# Altium project MB1814.PrjPcb (part 2 of 2)

## Sheet Connectors.SchDoc: Connectors
size A4; Date: Not used; ApprovedBy: Not used; CheckedBy: Not used; Author: Not used; CompanyName: STMicroelectronics; DrawnBy: Not used; Engineer: Not used; Organization: Not used; Address1: Not used; Address2: Not used; Address3: Not used; Address4: Not used; DocumentNumber: 6; Revision: Not used; SheetNumber: 6; SheetTotal: 8; CurrentTime: Not used; CurrentDate: Not used; Time: Not used; DocumentFullPathAndName: Not used; DocumentName: Not used; ModifiedDate: Not used; ImagePath: Not used; ProjectName: Not used; Application_BuildNumber: Not used
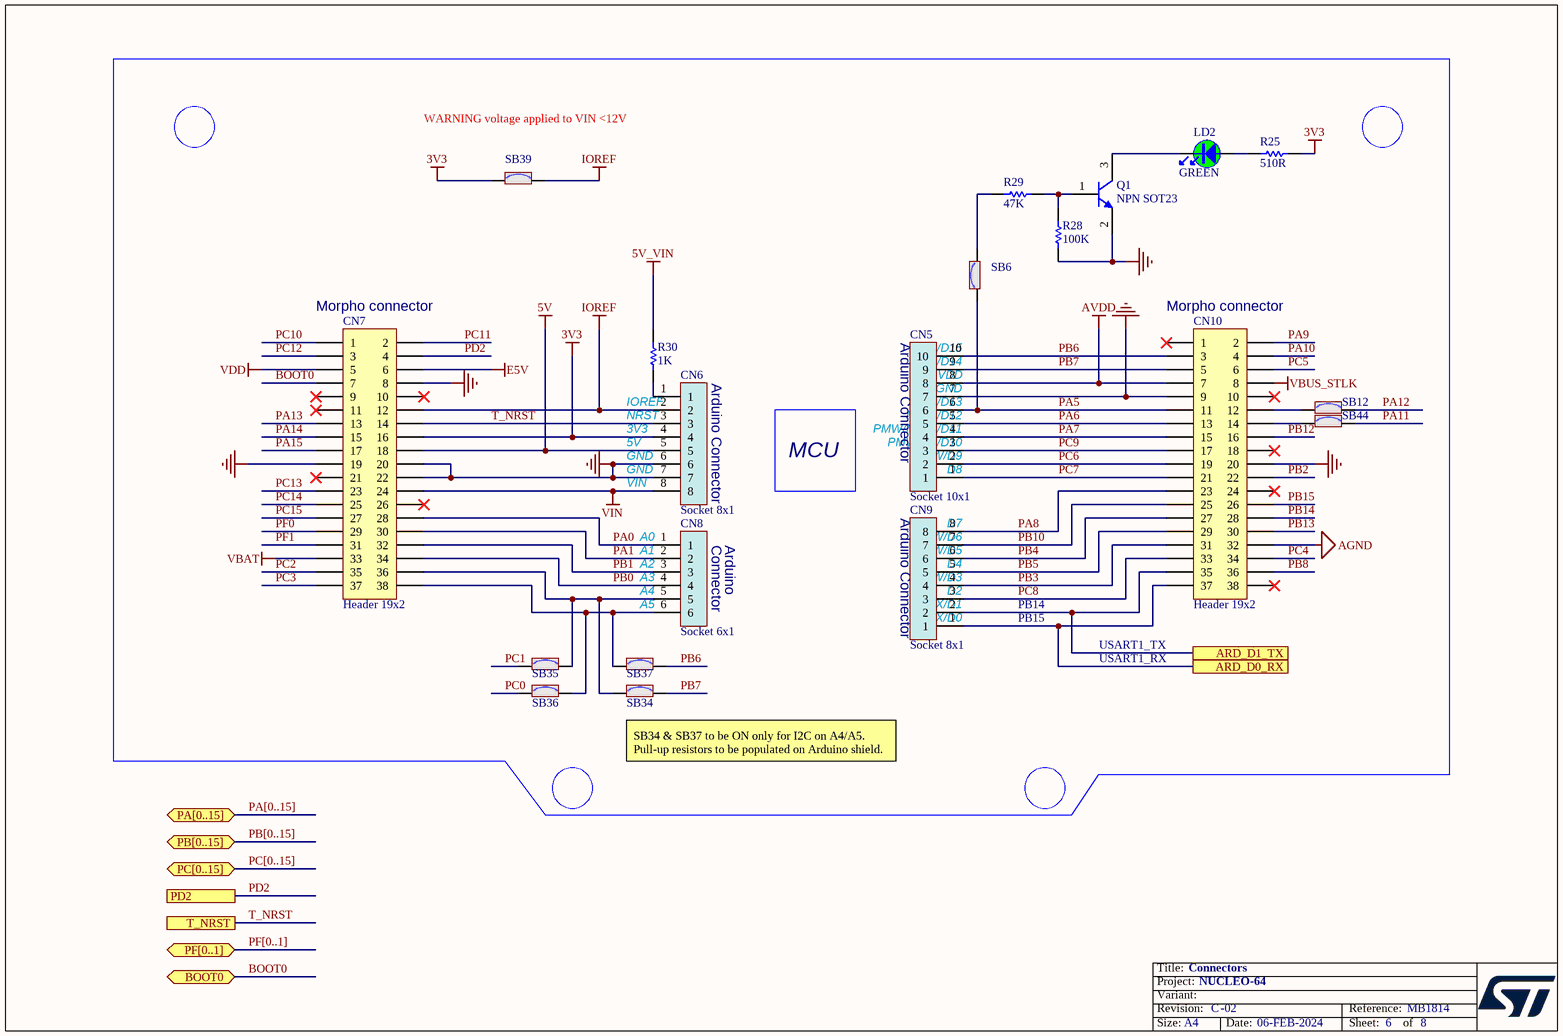
[diagram p6: Connectors.SchDoc]

### Parts
CN5  Socket 10x1  [CON_SAMTEC_SSQ-110-03-F-S]
CN6  Socket 8x1  [CON_SAMTEC_SSQ-108-03-F-S]
CN7  value Header 19x2  [CON_SAMTEC_TSW-119-09-X-D]
CN8  Socket 6x1  [CON_SAMTEC_SSQ-106-03-F-S]
CN9  Socket 8x1  [CON_SAMTEC_SSQ-108-03-F-S]
CN10  value Header 19x2  [CON_SAMTEC_TSW-119-09-X-D]
LD2  value GREEN  [LED_0603_OSRAM_LG-Q396-PS-35_GREEN_1A2K_H0P4]  (hidden comment: LED_green)
Q1  value NPN SOT23  [NPN_SOT23]
R25  value 510R  [R0603]
R28  value 100K  [R0603]
R29  value 47K  [R0603]
R30  value 1K  [R0603]
SB6  (no value)  [SOLDER-BRIDGE_R0603-0R]
SB12  (no value)  [SOLDER-BRIDGE_R0603-0R]
SB34  (no value)  [SOLDER-BRIDGE_R0603-0R]
SB35  (no value)  [SOLDER-BRIDGE_R0603-0R]
SB36  (no value)  [SOLDER-BRIDGE_R0603-0R]
SB37  (no value)  [SOLDER-BRIDGE_R0603-0R]
SB39  (no value)  [SOLDER-BRIDGE_R0603-0R]
SB44  (no value)  [SOLDER-BRIDGE_R0603-0R]

### Ports
ARD_D0_RX, ARD_D1_TX, BOOT0 (bidir), PA[0..15] (bidir), PB[0..15] (bidir), PC[0..15] (bidir), PD2, PF[0..1] (bidir), T_NRST

### Nets
3V3: CN6.4 CN7.16 R25.1 SB39.1
5V: CN6.5 CN7.18
5V_VIN: R30.2
AGND: CN10.32
AVDD: CN5.8 CN10.7
E5V: CN7.6
GND: CN5.7 CN6.6 CN6.7 CN7.8 CN7.19 CN7.20 CN7.22 CN10.9 CN10.20 Q1.2(E) R28.1
IOREF: CN6.2 CN7.12 SB39.2
VBAT: CN7.33
VBUS_STLK: CN10.8
VDD: CN7.5
VIN: CN6.8 CN7.24
ARD_D0_RX: CN9.1 CN10.37 ; port ARD_D0_RX
ARD_D1_TX: CN9.2 CN10.35 ; port ARD_D1_TX
BOOT0: CN7.7 ; port BOOT0
PA0: CN7.28 CN8.1
PA1: CN7.30 CN8.2
PA5: CN5.6 CN10.11 SB6.1
PA6: CN5.5 CN10.13
PA7: CN5.4 CN10.15
PA8: CN9.8 CN10.23
PA9: CN10.2
PA10: CN10.4
PA11: SB44.2
PA12: SB12.2
PA13: CN7.13
PA14: CN7.15
PA15: CN7.17
PB0: CN7.34 CN8.4
PB1: CN7.32 CN8.3
PB2: CN10.22
PB3: CN9.4 CN10.31
PB4: CN9.6 CN10.27
PB5: CN9.5 CN10.29
PB6: CN5.10 CN10.3 SB37.2
PB7: CN5.9 CN10.5 SB34.2
PB8: CN10.36
PB10: CN9.7 CN10.25
PB12: CN10.16
PB13: CN10.30
PB14: CN10.28
PB15: CN10.26
PC0: SB36.1
PC1: SB35.1
PC2: CN7.35
PC3: CN7.37
PC4: CN10.34
PC5: CN10.6
PC6: CN5.2 CN10.19
PC7: CN5.1 CN10.21
PC8: CN9.3 CN10.33
PC9: CN5.3 CN10.17
PC10: CN7.1
PC11: CN7.2
PC12: CN7.3
PC13: CN7.23
PC14: CN7.25
PC15: CN7.27
PD2: CN7.4 ; port PD2
PF0: CN7.29
PF1: CN7.31
T_NRST: CN6.3 CN7.14 ; port T_NRST
NetCN6_1: CN6.1 R30.1
NetCN7_36: CN7.36 CN8.5 SB34.1 SB35.2
NetCN7_38: CN7.38 CN8.6 SB36.2 SB37.1
NetCN10_12: CN10.12 SB12.1
NetCN10_14: CN10.14 SB44.1
NetLD2_1: LD2.1 R25.2
NetLD2_2: LD2.2 Q1.3(C)
NetQ1_1: Q1.1(B) R28.2 R29.2
NetR29_1: R29.1 SB6.2

Not connected (* = marked no-connect by the designer): CN7 9* 10* 11* 21* 26*; CN10 1* 10* 18* 24* 38*

### Buses and harness runs
bus PA[0..15] = port PA[0..15]
bus PB[0..15] = port PB[0..15]
bus PC[0..15] = port PC[0..15]
bus PF[0..1] = port PF[0..1]

### Notes on the sheet
- WARNING voltage applied to VIN <12V
- (near CN7) Morpho connector
- (near CN10) Morpho connector
- (near CN6) Arduino Connector
- (near CN5) Arduino Connector
- (near CN5) SDA/D14
- (near CN5) SCL/D15
- (near CN5) AVDD
- (near CN6) 5V
- 3V3
- NRST
- IOREF
- (near CN5) PMW/CS/D10
- (near CN5) SCK/D13
- (near CN5) MISO/D12
- (near CN5) PMW/MOSI/D11
- (near CN5) GND
- (near CN6) VIN
- (near CN6) GND
- MCU
- (near CN9) Arduino Connector
- (near CN5) D8
- (near CN5) PMW/D9
- (near CN8) A0
- (near CN8) A1
- (near CN8) A2
- (near CN8) A3
- (near CN8) Connector
- (near CN8) Arduino
- (near CN9) D4
- (near CN9) PMW/D3
- (near CN9) PMW/D5
- (near CN9) PMW/D6
- (near CN9) D7
- (near CN8) A4
- (near CN8) A5
- (near CN9) RX/D0
- (near CN9) TX/D1
- (near CN9) D2
- PB15
- PB14
- USART1_TX
- USART1_RX
- (near SB34) SB34 & SB37 to be ON only for I2C on A4/A5.
  Pull-up resistors to be populated on Arduino shield.
- Title:
- Project:
- Size:
- Revision:
- Variant:
- -
- Date:
- Reference:
- Sheet:
- of

### Library data of the parts
CN5 = MCD-02625: Socket, 10x1, 2.54mm, VR, TH, T=8.51mm/10mm; Part_Type: Connector; Part_Preference: Recommended; Manufacturer: SAMTEC; Manufacturer_Part_Number: SSQ-110-03-F-S; Order_Code_RS: 154-8308; Component_Country_Of_Origin: China, Costa Rica,  Malaysia, Vietnam, USA; ShowFields: YES; ID: 4731; Internal_Part_Number: MCD-02625; Value: Socket 10x1; Status: Checked; ComponentLink1URL: http://tunmcdsvn.tun.st.com/Component_Documentation_Library/Trunk/Connector/SAMTEC_SSQ_Series/; Order_Code_Digikey: SAM10010-ND; Order_Code_Farnell: 2667433
CN6 CN9 = MCD-02624: Socket, 8x1, 2.54mm, VR, TH, T=8.51mm/10mm; Part_Type: Connector; Part_Preference: Recommended; Manufacturer: SAMTEC; Manufacturer_Part_Number: SSQ-108-03-F-S; Order_Code_RS: 180-0395; Component_Country_Of_Origin: China, Costa Rica,  Malaysia, Vietnam, USA; ShowFields: YES; ID: 4730; Internal_Part_Number: MCD-02624; Value: Socket 8x1; Status: Checked; ComponentLink1URL: http://tunmcdsvn.tun.st.com/Component_Documentation_Library/Trunk/Connector/SAMTEC_SSQ_Series/; Order_Code_Digikey: SAM11912-ND; Order_Code_Farnell: 2505051
CN7 CN10 = MCD-00213: Header, 19x2, 2,54mm, VR, TH, Height 5.84mm/10.16mm; Manufacturer_Part_Number: TSW-119-09-x-D; Manufacturer: SAMTEC; Part_Type: Connector; Provided_By: SUBCO; Internal_Part_Number: MCD-00213; ECCN_US: n/a; ECCN_EU: n/a; ComponentLink1Description: Datasheet; Status: Released; ComponentLink1URL: http://tunmcdsvn.tun.st.com/Component_Datasheet_Library/Trunk/Connectors/Samtec_TSW-HTSW-series
CN8 = MCD-02623: Socket, 6x1, 2.54mm, VR, TH, T=8.51mm/10mm; Part_Type: Connector; Part_Preference: Recommended; Manufacturer: SAMTEC; Manufacturer_Part_Number: SSQ-106-03-F-S; Order_Code_RS: 180-0379; Component_Country_Of_Origin: China, Costa Rica,  Malaysia, Vietnam, USA; ShowFields: YES; ID: 4729; Internal_Part_Number: MCD-02623; Value: Socket 6x1; Status: Checked; ComponentLink1URL: http://tunmcdsvn.tun.st.com/Component_Documentation_Library/Trunk/Connector/SAMTEC_SSQ_Series/; Order_Code_Digikey: SAM10004-ND; Order_Code_Farnell: 2578705
LD2 = MCD-00588: LED Green, 0603 SMD, Forward Voltage Typ=2V, Max=2.5V; Part_Type: Display; Manufacturer_Part_Number: LG Q396-PS-35; Manufacturer: OSRAM OPTO SEMICONDUCTORS; Alternate_Manufacturer_Part_Number: VLMTG1300-GS08; Alternate_Manufacturer: VISHAY SEMICONDUCTOR OPTO DIVISION; Provided_By: SUBCO; Internal_Part_Number: MCD-00588; Status: Released; Package: LED 0603; ComponentLink1Description: Datasheet; ComponentLink1URL: http://tunmcdsvn.tun.st.com/Component_Datasheet_Library/Trunk/Display/OSRAM_LED_GREEN_LG Q396-PS-35; Order_Code_Digikey: LG Q396-PS-35-ND; ECCN_US: n/a; ECCN_EU: n/a
Q1 = MCD-00073: NPN Bipolar Transistor; Part_Type: IC; Manufacturer_Part_Number: BSR14; Manufacturer: ON SEMICONDUCTOR; Alternate_Manufacturer_Part_Number: MMBT2222LT1G / MMBT2222ALT1G / MMBT2222ALT3G; ECCN_US: EAR99; ECCN_EU: NEC; Provided_By: SUBCO; Revision: *; Internal_Part_Number: MCD-00073; Status: Released; ComponentLink1Description: Datasheet; ComponentLink1URL: http://tunmcdsvn.tun.st.com/Component_Datasheet_Library/Trunk/IC/NXP_Transistor_BSR14; Alternate_Manufacturer: ON SEMICONDUCTOR; Package: SOT23
R25 = MCD-00225: Resistor,510R,0603,1%,1/10W; Manufacturer_Part_Number: RC0603FR-07510RL; Manufacturer: YAGEO; ECCN_US: EAR99; ECCN_EU: NEC; Provided_By: SUBCO; Internal_Part_Number: MCD-00225; ComponentLink1Description: Datasheet; Status: Released; Part_Type: Resistor; Package: R0603; ComponentLink1URL: http://tunmcdsvn.tun.st.com/Component_Datasheet_Library/Trunk/Resistors/Yageo_Resistor_RC0603-series
R28 = MCD-00223: Resistor,100K,0603,1%,1/10W; Manufacturer_Part_Number: RC0603FR-07100KL; Manufacturer: YAGEO; Provided_By: Subcon; Initial_Board_Reference: MB1319; Internal_Part_Number: MCD-00223; Status: Released; Part_Type: Resistor; ComponentLink1Description: Yageo_Resistor_RC0603-series.pdf; ECCN_US: n/a; ECCN_EU: n/a; Package: R0603; ComponentLink1URL: http://tunmcdsvn.tun.st.com/Component_Datasheet_Library/Trunk/Resistors/Yageo_Resistor_RC0603-series
R29 = MCD-00222: Resistor,47K,0603,1%,1/10W; Manufacturer_Part_Number: RC0603FR-0747KL; Manufacturer: YAGEO; ECCN_US: EAR99; ECCN_EU: NEC; Provided_By: SUBCO; Internal_Part_Number: MCD-00222; Status: Released; Part_Type: Resistor; ComponentLink1Description: Datasheet; Package: R0603; ComponentLink1URL: http://tunmcdsvn.tun.st.com/Component_Datasheet_Library/Trunk/Resistors/Yageo_Resistor_RC0603-series
R30 = MCD-00070: Resistor,1K,0603,1%,1/10W; Manufacturer_Part_Number: RC0603FR-071KL; Manufacturer: YAGEO; Provided_By: Subcon; Initial_Board_Reference: MB1274; Internal_Part_Number: MCD-00070; ComponentLink1Description: Yageo_Resistor_RC0603-series.pdf; ECCN_US: n/a; ECCN_EU: n/a; Status: Released; Part_Type: Resistor; Package: R0603; ComponentLink1URL: http://tunmcdsvn.tun.st.com/Component_Datasheet_Library/Trunk/Resistors/Yageo_Resistor_RC0603-series
SB6 SB12 SB34-SB37 SB39 SB44 = MCD-00071: Solder Bridge ON; Part_Type: Mechanical; Manufacturer_Part_Number: RC0603JR-070RL; Manufacturer: YAGEO; Provided_By: SUBCO; Internal_Part_Number: MCD-00071; ECCN_US: n/a; ECCN_EU: n/a; Status: Released; Package: SB0603; ComponentLink1Description: Datasheet; ComponentLink1URL: http://tunmcdsvn.tun.st.com/Component_Datasheet_Library/Trunk/Resistors/Yageo_Resistor_RC0603-series

## Sheet STLINK_V3EC.SchDoc: STLINK_V3EC
size A3; Date: Not used; ApprovedBy: Not used; CheckedBy: Not used; Author: Not used; CompanyName: STMicroelectronics; DrawnBy: Not used; Engineer: Not used; Organization: Not used; Address1: Not used; Address2: Not used; Address3: Not used; Address4: Not used; DocumentNumber: 8; Revision: Not used; SheetNumber: 8; SheetTotal: 8; CurrentTime: Not used; CurrentDate: Not used; Time: Not used; DocumentFullPathAndName: Not used; DocumentName: Not used; ModifiedDate: Not used; ImagePath: Not used; ProjectName: Not used; Application_BuildNumber: Not used
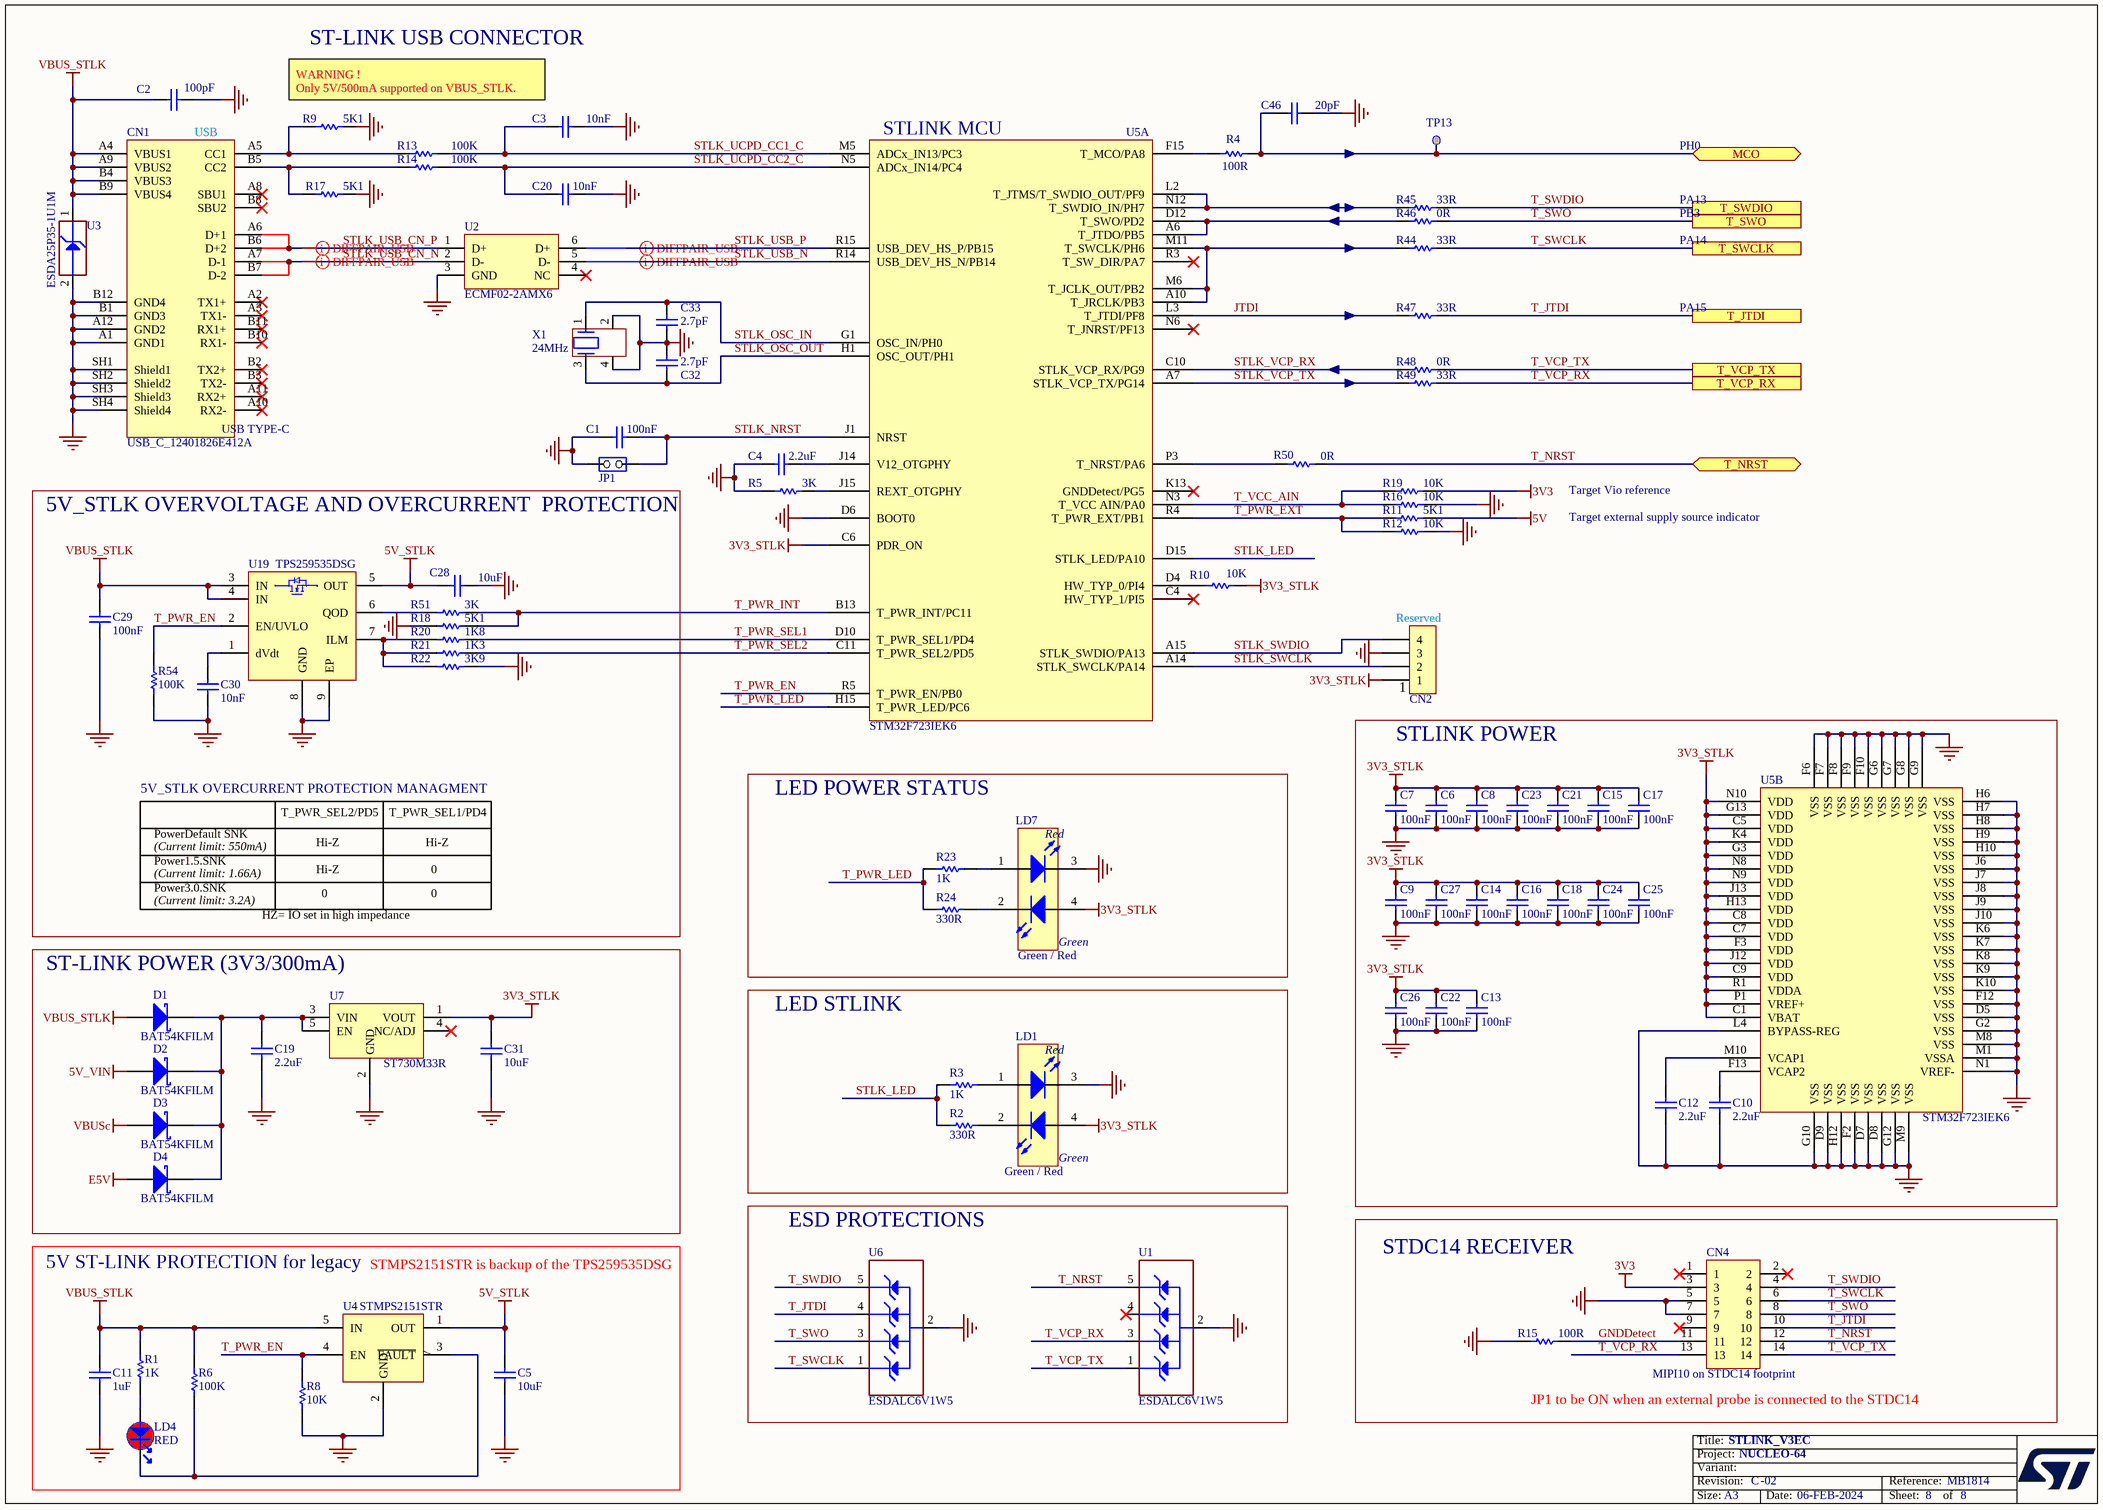
[diagram p7: STLINK_V3EC.SchDoc]

### Parts
C1  value 100nF  [C0402]  (hidden comment: Capacitor)
C2  value 100pF  [C0402]  (hidden comment: Capacitor)
C3  value 10nF  [C0402]  (hidden comment: Capacitor)
C4  value 2.2uF  [C0402]  (hidden comment: Capacitor)
C5  value 10uF  [C0603]  (hidden comment: Capacitor)
C6  value 100nF  [C0402]  (hidden comment: Capacitor)
C7  value 100nF  [C0402]  (hidden comment: Capacitor)
C8  value 100nF  [C0402]  (hidden comment: Capacitor)
C9  value 100nF  [C0402]  (hidden comment: Capacitor)
C10  value 2.2uF  [C0402]  (hidden comment: Capacitor)
C11  value 1uF  [C0603]  (hidden comment: Capacitor)
C12  value 2.2uF  [C0402]  (hidden comment: Capacitor)
C13  value 100nF  [C0402]  (hidden comment: Capacitor)
C14  value 100nF  [C0402]  (hidden comment: Capacitor)
C15  value 100nF  [C0402]  (hidden comment: Capacitor)
C16  value 100nF  [C0402]  (hidden comment: Capacitor)
C17  value 100nF  [C0402]  (hidden comment: Capacitor)
C18  value 100nF  [C0402]  (hidden comment: Capacitor)
C19  value 2.2uF  [C0805]  (hidden comment: Capacitor)
C20  value 10nF  [C0402]  (hidden comment: Capacitor)
C21  value 100nF  [C0402]  (hidden comment: Capacitor)
C22  value 100nF  [C0402]  (hidden comment: Capacitor)
C23  value 100nF  [C0402]  (hidden comment: Capacitor)
C24  value 100nF  [C0402]  (hidden comment: Capacitor)
C25  value 100nF  [C0402]  (hidden comment: Capacitor)
C26  value 100nF  [C0402]  (hidden comment: Capacitor)
C27  value 100nF  [C0402]  (hidden comment: Capacitor)
C28  value 10uF  [C0603]  (hidden comment: Capacitor)
C29  value 100nF  [C0402]  (hidden comment: Capacitor)
C30  value 10nF  [C0402]  (hidden comment: Capacitor)
C31  value 10uF  [C0603]  (hidden comment: Capacitor)
C32  value 2.7pF  [C0402]  (hidden comment: Capacitor)
C33  value 2.7pF  [C0402]  (hidden comment: Capacitor)
C46  value 20pF  [C0402]  (hidden comment: Capacitor)
CN1  value USB_C_12401826E412A  [CON_USB-TYPEC_AMPHENOL_12401826E412A]  (hidden comment: USB_TYPE_C_Receptacle)
CN2  Header 4x1  [CON_SAMTEC_TSW-104-07-G-S]  (value not drawn)
CN4  Header 7x2  [CON_STDC14_Receiver_MEDIUM_WITH_MIPI10_3D]  (value not drawn)
D1  value BAT54KFILM  [DIO_SOD523_1A_2K]  (hidden comment: SCHOTTKY_1A_2K)
D2  value BAT54KFILM  [DIO_SOD523_1A_2K]  (hidden comment: SCHOTTKY_1A_2K)
D3  value BAT54KFILM  [DIO_SOD523_1A_2K]  (hidden comment: SCHOTTKY_1A_2K)
D4  value BAT54KFILM  [DIO_SOD523_1A_2K]  (hidden comment: SCHOTTKY_1A_2K)
JP1  Jumper_Header 2x1  [CON_SAMTEC_TSW-102-07-G-S]  (value not drawn)
LD1  value Green / Red  [LED_BI-GR_WE-150141SV73110]  (hidden comment: LED_BICOLOR)
LD4  value RED  [LED_0603_VISHAY_VLMS1300-GS08_RED_1A2K_H0P8]  (hidden comment: LED_red)
LD7  value Green / Red  [LED_BI-GR_WE-150141SV73110]  (hidden comment: LED_BICOLOR)
R1  value 1K  [R0402]  (hidden comment: Resistor)
R2  value 330R  [R0402]  (hidden comment: Resistor)
R3  value 1K  [R0402]  (hidden comment: Resistor)
R4  value 100R  [R0402]  (hidden comment: Resistor)
R5  value 3K  [R0402]  (hidden comment: Resistor)
R6  value 100K  [R0402]  (hidden comment: Resistor)
R8  value 10K  [R0402]  (hidden comment: Resistor)
R9  value 5K1  [R0402]  (hidden comment: Resistor)
R10  value 10K  [R0402]  (hidden comment: Resistor)
R11  value 5K1  [R0402]  (hidden comment: Resistor)
R12  value 10K  [R0402]  (hidden comment: Resistor)
R13  value 100K  [R0402]  (hidden comment: Resistor)
R14  value 100K  [R0402]  (hidden comment: Resistor)
R15  value 100R  [R0402]  (hidden comment: Resistor)
R16  value 10K  [R0402]  (hidden comment: Resistor)
R17  value 5K1  [R0402]  (hidden comment: Resistor)
R18  value 5K1  [R0402]  (hidden comment: Resistor)
R19  value 10K  [R0402]  (hidden comment: Resistor)
R20  value 1K8  [R0402]  (hidden comment: Resistor)
R21  value 1K3  [R0402]  (hidden comment: Resistor)
R22  value 3K9  [R0402]  (hidden comment: Resistor)
R23  value 1K  [R0402]  (hidden comment: Resistor)
R24  value 330R  [R0402]  (hidden comment: Resistor)
R44  value 33R  [R0402]  (hidden comment: Resistor)
R45  value 33R  [R0402]  (hidden comment: Resistor)
R46  value 0R  [R0402]  (hidden comment: Resistor)
R47  value 33R  [R0402]  (hidden comment: Resistor)
R48  value 0R  [R0402]  (hidden comment: Resistor)
R49  value 33R  [R0402]  (hidden comment: Resistor)
R50  value 0R  [R0402]  (hidden comment: Resistor)
R51  value 3K  [R0402]  (hidden comment: Resistor)
R54  value 100K  [R0402]  (hidden comment: Resistor)
TP13  Test Point  [TP_SMD_1MM]  (value not drawn)  (no BOM)
U1  ESDALC6V1W5  [ESD_SOT323-5L]
U2  ECMF02-2AMX6  [ESD_QFN-6L_1P7X1P5_P050]
U3  value ESDA25P35-1U1M  [ESD_QFN1610_2N_1K_2A]  (hidden comment: ESD-TRANSIL)
U4  STMPS2151STR  [MOS_SOT23-5L]
U5  value STM32F723IEK6  [ICC_UFBGA201_176+25_10X10_P065]  (hidden comment: STLINK-V3EC)  (parts A,B of 2)
U6  ESDALC6V1W5  [ESD_SOT323-5L]
U7  ST730M33R  [ICC_SOT23-5L_H1P45]
U19  TPS259535DSG  [ICC_WSON8-EPAD_2X2_P050]
X1  value 24MHz  [CRY_NX2016SA_4P]  (hidden comment: XTAL_4_PINS)

### Blocks framed on the sheet
5V_STLK OVERVOLTAGE AND OVERCURRENT  PROTECTION: C28-C30 R18 R20-R22 R51 R54 U19
LED POWER STATUS: LD7 R23 R24
STLINK POWER: C6-C10 C12-C18 C21-C27 U5
ST-LINK POWER (3V3/300mA): C19 C31 D1-D4 U7
LED STLINK: LD1 R2 R3
ESD PROTECTIONS: U1 U6
5V ST-LINK PROTECTION for legacy: C5 C11 LD4 R1 R6 R8 U4
STDC14 RECEIVER: CN4 R15

### Ports
MCO (bidir), T_JTDI, T_NRST (bidir), T_SWCLK, T_SWDIO, T_SWO, T_VCP_RX, T_VCP_TX

### Nets
3V3: CN4.3 R19.2
3V3_STLK: C6.1 C7.1 C8.1 C9.1 C13.1 C14.1 C15.1 C16.1 C17.1 C18.1 C21.1 C22.1 C23.1 C24.1 C25.1 C26.1 C27.1 C31.2 CN2.1 LD1.4(Green_anode) LD7.4(Green_anode) R10.2 U5.C1(VBAT) U5.C5(VDD) U5.C6(PDR_ON) U5.C7(VDD) U5.C8(VDD) U5.C9(VDD) U5.F3(VDD) U5.G3(VDD) U5.G13(VDD) U5.H13(VDD) U5.J12(VDD) U5.J13(VDD) U5.K4(VDD) U5.N8(VDD) U5.N9(VDD) U5.N10(VDD) U5.P1(VREF+) U5.R1(VDDA) U7.1(VOUT)
5V: R11.2
5V_STLK: C5.2 C28.2 U4.1(OUT) U19.5(OUT)
5V_VIN: D2.1(A)
E5V: D4.1(A)
GND: C1.1 C2.2 C3.2 C4.1 C5.1 C6.2 C7.2 C8.2 C9.2 C10.1 C11.1 C12.1 C13.2 C14.2 C15.2 C16.2 C17.2 C18.2 C19.1 C20.2 C21.2 C22.2 C23.2 C24.2 C25.2 C26.2 C27.2 C28.1 C29.1 C30.1 C31.1 C32.1 C33.1 C46.1 CN1.A1(GND1) CN1.A12(GND2) CN1.B1(GND3) CN1.B12(GND4) CN1.SH1(Shield1) CN1.SH2(Shield2) CN1.SH3(Shield3) CN1.SH4(Shield4) CN2.3 CN4.5 CN4.7 JP1.2(NO) LD1.3(RED_cathode) LD7.3(RED_cathode) R5.2 R8.1 R9.2 R12.2 R15.1 R16.2 R17.2 R18.1 R22.2 R54.1 U1.2(GND) U2.3(GND) U3.2(GND) U4.2(GND) U5.D5(VSS) U5.D6(BOOT0) U5.D7(VSS) U5.D8(VSS) U5.D9(VSS) U5.F2(VSS) U5.F6(VSS) U5.F7(VSS) U5.F8(VSS) U5.F9(VSS) U5.F10(VSS) U5.F12(VSS) U5.G2(VSS) U5.G6(VSS) U5.G7(VSS) U5.G8(VSS) U5.G9(VSS) U5.G10(VSS) U5.G12(VSS) U5.H6(VSS) U5.H7(VSS) U5.H8(VSS) U5.H9(VSS) U5.H10(VSS) U5.H12(VSS) U5.J6(VSS) U5.J7(VSS) U5.J8(VSS) U5.J9(VSS) U5.J10(VSS) U5.K6(VSS) U5.K7(VSS) U5.K8(VSS) U5.K9(VSS) U5.K10(VSS) U5.L4(BYPASS-REG) U5.M1(VSSA) U5.M8(VSS) U5.M9(VSS) U5.N1(VREF-) U6.2(GND) U7.2(GND) U19.8(GND) U19.9(EP) X1.2 X1.4
VBUS_STLK: C2.1 C11.2 C29.2 CN1.A4(VBUS1) CN1.A9(VBUS2) CN1.B4(VBUS3) CN1.B9(VBUS4) D1.1(A) R1.2 R6.2 U3.1(IO1) U4.5(IN) U19.3(IN) U19.4(IN)
VBUSc: D3.1(A)
GNDDetect: CN4.11 R15.2
JTDI: R47.1 U5.L3(T_JTDI/PF8)
MCO: C46.2 R4.2 TP13.1 ; port MCO
STLK_LED: R2.1 R3.2 U5.D15(STLK_LED/PA10)
STLK_NRST: C1.2 JP1.1(COMMON) U5.J1(NRST)
STLK_OSC_IN: C33.2 U5.G1(OSC_IN/PH0) X1.1
STLK_OSC_OUT: C32.2 U5.H1(OSC_OUT/PH1) X1.3
STLK_SWCLK: CN2.2 U5.A14(STLK_SWCLK/PA14)
STLK_SWDIO: CN2.4 U5.A15(STLK_SWDIO/PA13)
STLK_UCPD_CC1_C: C3.1 R13.2 U5.M5(ADCx_IN13/PC3)
STLK_UCPD_CC2_C: C20.1 R14.2 U5.N5(ADCx_IN14/PC4)
STLK_USB_CN_N: CN1.A7(D-1) CN1.B7(D-2) U2.2(D-)
STLK_USB_CN_P: CN1.A6(D+1) CN1.B6(D+2) U2.1(D+)
STLK_USB_N: U2.5(D-) U5.R14(USB_DEV_HS_N/PB14)
STLK_USB_P: U2.6(D+) U5.R15(USB_DEV_HS_P/PB15)
STLK_VCP_RX: R48.1 U5.C10(STLK_VCP_RX/PG9)
STLK_VCP_TX: R49.1 U5.A7(STLK_VCP_TX/PG14)
T_JTDI: CN4.10 R47.2 U6.4(IO3) ; port T_JTDI
T_NRST: CN4.12 R50.2 U1.5(IO4) ; port T_NRST
T_PWR_EN: R8.2 R54.2 U4.4(EN) U5.R5(T_PWR_EN/PB0) U19.2(EN/UVLO)
T_PWR_EXT: R11.1 R12.1 U5.R4(T_PWR_EXT/PB1)
T_PWR_INT: R18.2 R51.2 U5.B13(T_PWR_INT/PC11)
T_PWR_LED: R23.2 R24.2 U5.H15(T_PWR_LED/PC6)
T_PWR_SEL1: R20.2 U5.D10(T_PWR_SEL1/PD4)
T_PWR_SEL2: R21.2 U5.C11(T_PWR_SEL2/PD5)
T_SWCLK: CN4.6 R44.2 U6.1(IO1) ; port T_SWCLK
T_SWDIO: CN4.4 R45.2 U6.5(IO4) ; port T_SWDIO
T_SWO: CN4.8 R46.2 U6.3(IO2) ; port T_SWO
T_VCC_AIN: R16.1 R19.1 U5.N3(T_VCC_AIN/PA0)
T_VCP_RX: CN4.13 R49.2 U1.3(IO2) ; port T_VCP_RX
T_VCP_TX: CN4.14 R48.2 U1.1(IO1) ; port T_VCP_TX
NetC4_2: C4.2 U5.J14(V12_OTGPHY)
NetC10_2: C10.2 U5.F13(VCAP2)
NetC12_2: C12.2 U5.M10(VCAP1)
NetC19_2: C19.2 D1.2(K) D2.2(K) D3.2(K) D4.2(K) U7.3(VIN) U7.5(EN)
NetC30_2: C30.2 U19.1(dVdt)
NetCN1_A5: CN1.A5(CC1) R9.1 R13.1
NetCN1_B5: CN1.B5(CC2) R14.1 R17.1
NetLD1_1: LD1.1(Red_anode) R3.1
NetLD1_2: LD1.2(Green_cathode) R2.2
NetLD4_1: LD4.1 R1.1
NetLD4_2: LD4.2 R6.1 U4.3(~{FAULT})
NetLD7_1: LD7.1(Red_anode) R23.1
NetLD7_2: LD7.2(Green_cathode) R24.1
NetR4_1: R4.1 U5.F15(T_MCO/PA8)
NetR5_1: R5.1 U5.J15(REXT_OTGPHY)
NetR10_1: R10.1 U5.D4(HW_TYP_0/PI4)
NetR20_1: R20.1 R21.1 R22.1 U19.7(ILM)
NetR44_1: R44.1 U5.A10(T_JRCLK/PB3) U5.M6(T_JCLK_OUT/PB2) U5.M11(T_SWCLK/PH6)
NetR45_1: R45.1 U5.L2(T_JTMS/T_SWDIO_OUT/PF9) U5.N12(T_SWDIO_IN/PH7)
NetR46_1: R46.1 U5.A6(T_JTDO/PB5) U5.D12(T_SWO/PD2)
NetR50_1: R50.1 U5.P3(T_NRST/PA6)
NetR51_1: R51.1 U19.6(QOD)

Not connected (* = marked no-connect by the designer): CN1 A2(TX1+)* A3(TX1-)* A8(SBU1)* A10(RX2-)* A11(RX2+)* B2(TX2+)* B3(TX2-)* B8(SBU2)* B10(RX1-)* B11(RX1+)*; CN4 1* 2* 9*; U1 4(IO3)*; U2 4(NC)*; U5 C4(HW_TYP_1/PI5)* K13(GNDDetect/PG5)* N6(T_JNRST/PF13)* R3(T_SW_DIR/PA7)*; U7 4(NC/ADJ)*

### Layout directives
differential pair; rule Impedance Constraint [Min = 85.00    Max = 95.00    ]: STLK_USB_CN_N, STLK_USB_CN_P, STLK_USB_N, STLK_USB_P

### Notes on the sheet
- ST-LINK USB CONNECTOR
- WARNING !
  Only 5V/500mA supported on VBUS_STLK.
- (near CN1) USB
- (near U5) STLINK MCU
- PH0
- PA13
- PA14
- PB3
- PA15
- Target Vio reference
- Target external supply source indicator
- (near CN2) Reserved
- (near CN2) 1
- 5V_STLK OVERCURRENT PROTECTION MANAGMENT
- PowerDefault SNK
- (Current limit: 550mA)
- T_PWR_SEL2/PD5
- Hi-Z
- T_PWR_SEL1/PD4
- Power1.5.SNK
- (Current limit: 1.66A)
- Power3.0.SNK
- (Current limit: 3.2A)
- HZ= IO set in high impedance
- 0
- STMPS2151STR is backup of the TPS259535DSG
- (near CN4) MIPI10 on STDC14 footprint
- JP1 to be ON when an external probe is connected to the STDC14
- Title:
- Project:
- Size:
- Revision:
- Variant:
- A3
- -
- Date:
- Reference:
- Sheet:
- of
- (in symbol MCD-02631) Red; Green
- (in symbol MCD-03232) USB TYPE-C

### Library data of the parts
C1 C6-C9 C13-C18 C21-C27 = MCD-00006: Capacitor, MLCC, 100nF, 16V, X7R, 10%, 0402, T=0.5mm; Manufacturer_Part_Number: CC0402KRX7R7BB104; Manufacturer: YAGEO; Alternate_Manufacturer_Part_Number: GCM155R71C104KA55D; Alternate_Manufacturer: MURATA; Provided_By: SUBCO; Internal_Part_Number: MCD-00006; ComponentLink1Description: Datasheet; Status: Released; Package: C0402; Part_Type: Capacitor; ComponentLink1URL: http://tunmcdsvn.tun.st.com/Component_Datasheet_Library/Trunk/Capacitors/Yageo_Multilayer_Capacitor_X7R_series_100pF_to_22uF
C2 = MCD-00205: Capacitor, MLCC, 100pF, 50V, NPO, +/-5%, 0402, T=0.5mm; Part_Preference: Recommended; Manufacturer: YAGEO; Manufacturer_Part_Number: CC0402JRNPO9BN101; Component_Country_Of_Origin: China; Internal_Part_Number: MCD-00205; Status: Released; Part_Type: Capacitor; Package: 0402; ComponentLink1URL: http://tunmcdsvn.tun.st.com/Component_Documentation_Library/Trunk/Capacitor/YAGEO_NP0_Series; Order_Code_Digikey: 311-1024-1-ND; Order_Code_Farnell: 3019226RL; Order_Code_RS: N/A
C3 C20 = MCD-02198: Capacitor, MLCC, 10nF, 50V, X7R, +/-10%, 0402, T=0.5mm; Part_Preference: Recommended; Manufacturer: YAGEO; Manufacturer_Part_Number: CC0402KRX7R9BB103; Order_Code_RS: 6169644; Component_Country_Of_Origin: China; Internal_Part_Number: MCD-02198; Status: Checked; Part_Type: Capacitor; Package: 0402; ComponentLink1URL: http://tunmcdsvn.tun.st.com/Component_Documentation_Library/Trunk/Capacitor/YAGEO_X7R_Series; Order_Code_Digikey: N/A; Order_Code_Farnell: N/A
C4 C10 C12 = MCD-02606: Capacitor, MLCC, 2.2uF, 6.3V, X5R, +/-10%, 0402, T=0.5mm; Part_Preference: Recommended; Manufacturer: YAGEO; Manufacturer_Part_Number: CC0402KRX5R5BB225; Order_Code_RS: 1992205; Internal_Part_Number: MCD-02606; Status: New; Part_Type: Capacitor; Package: 0402; ComponentLink1URL: http://tunmcdsvn.tun.st.com/Component_Documentation_Library/Trunk/Capacitor/YAGEO_X5R_Series; Order_Code_Digikey: 311-1682-2-ND; Order_Code_Farnell: 3366429
C5 C28 C31 = MCD-00099: Capacitor, MLCC, 10uF, 10V, X5R, +/-10%, 0603, T=0.8mm; Part_Preference: Recommended; Manufacturer: MURATA; Manufacturer_Part_Number: GRM188R61A106KE69D; Order_Code_RS: 170-6168; Component_Country_Of_Origin: Japan; Internal_Part_Number: MCD-00099; Status: Released; Part_Type: Capacitor; Package: 0603; ComponentLink1URL: http://tunmcdsvn.tun.st.com/Component_Documentation_Library/Trunk/Capacitor/MURATA_GRM_Series; Order_Code_Digikey: 490-10474-1-ND; Order_Code_Farnell: 2494233
C11 = MCD-00010: Capacitor, MLCC, 1uF, 16V, X5R, 10%, 0603, T=0,8mm; Manufacturer_Part_Number: CC0603KRX5R7BB105; Manufacturer: YAGEO; Provided_By: SUBCO; Initial_Board_Reference: MB1274; Item Type: Item; Path: ws/MCD_ApplicationBoards/Lists/MCDPARTSdatabase; Internal_Part_Number: MCD-00010; Status: Released; Part_Type: Capacitor; Package: C0603; ComponentLink1Description: Datasheet; ComponentLink1URL: http://tunmcdsvn.tun.st.com/Component_Datasheet_Library/Trunk/Capacitors/Yageo_Multilayer_capacitor_X5R_series_100pF_to_100uF
C19 = MCD-02372: Capacitor, MLCC, 2.2uF, 25V, X7R, +/-10%, 0805, T=1,25mm; Manufacturer_Part_Number: GRM21BR71E225KE11L; Manufacturer: MURATA; Part_Preference: Recommended; ECCN_US: EAR99; ECCN_EU: NEC; Provided_By: SUBCO; Internal_Part_Number: MCD-02372; Status: Checked; Part_Type: Capacitor; Alternate_Manufacturer_Part_Number: N/A; Alternate_Manufacturer: N/A; Package: C0805; ComponentLink1Description: Datasheet; ComponentLink1URL: http://tunmcdsvn.tun.st.com/Component_Documentation_Library/Trunk/Capacitor/MURATA_GRM_Series/GRM21BR71E225KE11; Order_Code_Digikey: 490-14467; Order_Code_Farnell: 2688538; Order_Code_RS: N/A
C29 = MCD-02355: Capacitor, MLCC, 100nF, 25V, X7R, +/-10%, 0402, T=0.5mm; Part_Preference: Recommended; Manufacturer: WALSIN; Manufacturer_Part_Number: 0402B104K250CT; Order_Code_RS: 176-3114; Component_Country_Of_Origin: Unknown; Internal_Part_Number: MCD-02355; Status: Checked; Part_Type: Capacitor; Package: 0402; ComponentLink1URL: http://tunmcdsvn.tun.st.com/Component_Documentation_Library/Trunk/Capacitor/WALSIN_Monolithic_Series/; Order_Code_Digikey: 1292-1175-1-ND; Order_Code_Farnell: 2496772
C30 = MCD-02198: Capacitor, MLCC, 10nF, 50V, X7R, +/-10%, 0402, T=0.5mm; Part_Preference: Recommended; Manufacturer: YAGEO; Manufacturer_Part_Number: CC0402KRX7R9BB103; Order_Code_RS: 6169644; Component_Country_Of_Origin: China; ShowFields: YES; ID: 4298; Internal_Part_Number: MCD-02198; Status: Checked; Part_Type: Capacitor; Package: 0402; ComponentLink1URL: http://tunmcdsvn.tun.st.com/Component_Documentation_Library/Trunk/Capacitor/YAGEO_X7R_Series; Order_Code_Digikey: N/A; Order_Code_Farnell: N/A
C32 C33 = MCD-01774: Capacitor, MLCC, 2.7pF, 50V, NPO, +/-0.1pF, 0402, T=0.5mm; Part_Preference: Recommended; Manufacturer: YAGEO; Manufacturer_Part_Number: CC0402BRNPO9BN2R7; Component_Country_Of_Origin: China; Internal_Part_Number: MCD-01774; Status: Released; Part_Type: Capacitor; Package: 0402; ComponentLink1URL: http://tunmcdsvn.tun.st.com/Component_Documentation_Library/Trunk/Capacitor/YAGEO_NP0_Series; Order_Code_Digikey: 311-1619-1-ND; Order_Code_Farnell: N/A; Order_Code_RS: N/A
C46 = MCD-00016: Capacitor, MLCC, 20pF, 50V, NPO, +/- 5%, 0402, T=0.5mm; Part_Preference: Recommended; Manufacturer: YAGEO; Manufacturer_Part_Number: CC0402JRNPO9BN200; Component_Country_Of_Origin: China; ShowFields: YES; ID: 2479; Internal_Part_Number: MCD-00016; Status: Released; Part_Type: Capacitor; Package: 0402; ComponentLink1URL: http://tunmcdsvn.tun.st.com/Component_Documentation_Library/Trunk/Capacitor/YAGEO_NP0_Series; Order_Code_Digikey: 311-1417-1-ND; Order_Code_Farnell: N/A; Order_Code_RS: N/A
CN1 = MCD-03232: USB_TypeC, 24 pins, RA, SMD, T=2.96mm; Part_Type: Connector; Part_Preference: Recommended; Manufacturer: AMPHENOL ICC; Manufacturer_Part_Number: 12401826E412A; Component_Country_Of_Origin: China°; ShowFields: YES; ID: 5348; Internal_Part_Number: MCD-03232; Status: Released; ComponentLink1URL: http://tunmcdsvn.tun.st.com/Component_Documentation_Library/Trunk/Connector/AMPHEMOL_ICC_12401826E412A; Order_Code_Digikey: 12401826E412ATR-ND; Order_Code_Farnell: 3727763; Order_Code_RS: N/A
CN2 = MCD-00029: Header, 4x1, 2,54mm, VR, TH, Height 5.84mm/2.54mm; Manufacturer_Part_Number: TSW-104-07-x-S; Manufacturer: SAMTEC; Part_Type: Connector; Provided_By: SUBCO; Internal_Part_Number: MCD-00029; Status: Released; ComponentLink1Description: Datasheet; ComponentLink1URL: http://tunmcdsvn.tun.st.com/Component_Datasheet_Library/Trunk/Connectors/Samtec_TSW-HTSW-series
CN4 = MCD-01226: Header, 5x2, 1.27mm, VR, SMD, T=5.97mm/3.05mm; Part_Type: Connector; Part_Preference: Recommended; Manufacturer: SAMTEC; Manufacturer_Part_Number: FTSH-105-01-L-DV-K; Value: Header 5x2; Order_Code_RS: 159-2332; Component_Country_Of_Origin: China, Costa Rica, Malaysia, United States, Vietnam; Internal_Part_Number: MCD-01226; Status: Released; ComponentLink1URL: http://tunmcdsvn.tun.st.com/Component_Documentation_Library/Trunk/Connector/SAMTEC_FTSH_Series/; Order_Code_Digikey: SAM8799-ND; Order_Code_Farnell: 2856879
D1-D4 = MCD-01677: Small signal Schottky diodes; BMS_Part_Number: 9151123; Part_Type: Diode; Part_Preference: Recommended; Manufacturer: STMICROELECTRONICS; Manufacturer_HQ_COO: EU; Component_Country_Of_Origin: China; Internal_Part_Number: MCD-01677; Status: Checked; Manufacturer_Part_Number: BAT54KFILM; Package: SOD-523; ComponentLink1URL: http://tunmcdsvn.tun.st.com/Component_Datasheet_Library/Trunk/Diodes/STM_SCHOTTKY_DOUBLE_BAT54SWFILM/STM_SCHOTTKY_DOUBLE_BAT54SWFILM.pdf
JP1 = MCD-00045: Header, 2x1, 2,54mm, VR, TH, Height 5.84mm/2.54mm; Part_Preference: Recommended; Part_Type: Connector; Manufacturer: SAMTEC; Manufacturer_Part_Number: TSW-102-07-G-S; Alternate_Manufacturer: JIUBABA; LIANYI; Alternate_Manufacturer_Part_Number: 313102S111116;313102S111116; Internal_Part_Number: MCD-00045; Status: Released; ComponentLink1Description: Datasheet; ComponentLink1URL: http://tunmcdsvn.tun.st.com/Component_Datasheet_Library/Trunk/Connectors/Samtec_TSW-HTSW-series
LD1 LD7 = MCD-02631: LED Bicolor, Green/Red, 2V, 20mA,  4-PLCC; Part_Type: Display; Part_Preference: Recommended; Manufacturer: WURTH ELEKTRONIK; Manufacturer_Part_Number: 150141SV73110; Order_Code_RS: 184-6963; Internal_Part_Number: MCD-02631; Status: Checked; Package: 4-PLCC; ComponentLink1URL: http://tunmcdsvn.tun.st.com/Component_Documentation_Library/Trunk/Display/WURTH_ELEKTRONIK_150141SV73110; Order_Code_Digikey: 732-13404-2-ND; Order_Code_Farnell: 2990869
LD4 = MCD-00587: LED Red, 0603 SMD, 2V Forward Voltage; Part_Type: Display; Manufacturer_Part_Number: VLMS1300-GS08; Manufacturer: VISHAY; Alternate_Manufacturer_Part_Number: LS Q976-NR-1; Alternate_Manufacturer: OSRAM OPTO SEMICONDUCTORS; Provided_By: SUBCO; Internal_Part_Number: MCD-00587; Status: Released; Package: LED 0603; ComponentLink1Description: Datasheet; ComponentLink1URL: http://tunmcdsvn.tun.st.com/Component_Datasheet_Library/Trunk/Display/VISHAY_LED_RED_VLMS1300-GS08; Order_Code_Digikey: VLMS1300-GS08CT-ND; Order_Code_Farnell: 2078728; ECCN_US: n/a; ECCN_EU: n/a
R1 = MCD-00061: Resistor,1K,0402,1%,1/16W; Manufacturer_Part_Number: RC0402FR-071KL; Manufacturer: YAGEO; Provided_By: SUBCO; Initial_Board_Reference: MB1274; Item Type: Item; Path: ws/MCD_ApplicationBoards/Lists/MCDPARTSdatabase; Internal_Part_Number: MCD-00061; Status: Released; Part_Type: Resistor; Package: R0402; ComponentLink1Description: Datasheet; ComponentLink1URL: http://tunmcdsvn.tun.st.com/Component_Datasheet_Library/Trunk/Resistors/Yageo_Resistor_RC0402-series
R2 R24 = MCD-00062: Resistor, 330R, 0402, +/-1%, 1/16W; Part_Preference: Recommended; Manufacturer: YAGEO; Manufacturer_Part_Number: RC0402FR-07330RL; Component_Country_Of_Origin: China; Internal_Part_Number: MCD-00062; Status: Released; Part_Type: Resistor; Package: 0402; ComponentLink1URL: http://tunmcdsvn.tun.st.com/Component_Documentation_Library/Trunk/Resistor/YAGEO_RC_L_Series; Order_Code_Digikey: 311-330LRCT-ND; Order_Code_Farnell: 9239170; Order_Code_RS: N/A
R3 R23 = MCD-02665: Resistor, 1K, 0402, +/-0.1%, 1/16W, +/-25ppm/°C; Part_Preference: Recommended; Manufacturer: YAGEO; Manufacturer_Part_Number: RT0402BRD071KL; Order_Code_RS: 199-1298; Internal_Part_Number: MCD-02665; Status: Checked; Part_Type: Resistor; Package: 0402; ComponentLink1URL: http://tunmcdsvn.tun.st.com/Component_Documentation_Library/Trunk/Resistor/YAGEO_RT_Series; Order_Code_Digikey: YAG1386TR-ND; Order_Code_Farnell: 3496475
R4 R15 = MCD-00067: Resistor, 100R, 0402, +/- 1%, 1/16W; Part_Preference: Recommended; Manufacturer: YAGEO; Manufacturer_Part_Number: RC0402FR-07100RL; Order_Code_RS: 9239111; Component_Country_Of_Origin: China; ShowFields: YES; ID: 2527; Internal_Part_Number: MCD-00067; Status: Released; Part_Type: Resistor; Package: 0402; ComponentLink1URL: http://tunmcdsvn.tun.st.com/Component_Documentation_Library/Trunk/Resistor/YAGEO_RC_L_Series; Order_Code_Digikey: 311-100LRCT-ND; Order_Code_Farnell: 9239111
R5 = MCD-00185: Resistor,3K,0402,1%,1/16W; Manufacturer_Part_Number: RC0402FR-073KL; Manufacturer: YAGEO; Provided_By: SUBCO; Internal_Part_Number: MCD-00185; Status: Released; ComponentLink1Description: Datasheet; Part_Type: Resistor; ComponentLink1URL: http://tunmcdsvn.tun.st.com/Component_Datasheet_Library/Trunk/Resistors/Yageo_Resistor_RC0402-series; Package: R0402
R6 R54 = MCD-00059: Resistor,100K,0402,1%,1/16W; Manufacturer_Part_Number: RC0402FR-07100KL; Manufacturer: YAGEO; Alternate_Manufacturer_Part_Number: RT0402FRE07100KL; Provided_By: SUBCO; Initial_Board_Reference: MB1274; Item Type: Item; Path: ws/MCD_ApplicationBoards/Lists/MCDPARTSdatabase; Internal_Part_Number: MCD-00059; Status: Released; Part_Type: Resistor; Alternate_Manufacturer: YAGEO; Package: R0402; ComponentLink1Description: Datasheet; ComponentLink1URL: http://tunmcdsvn.tun.st.com/Component_Datasheet_Library/Trunk/Resistors/Yageo_Resistor_RC0402-series
R8 = MCD-00053: Resistor,10K,0402,1%,1/16W; Manufacturer_Part_Number: RC0402FR-0710KL; Manufacturer: YAGEO; Provided_By: SUBCO; Initial_Board_Reference: MB1274; Item Type: Item; Path: ws/MCD_ApplicationBoards/Lists/MCDPARTSdatabase; Internal_Part_Number: MCD-00053; Status: Released; Part_Type: Resistor; Package: R0402; ComponentLink1Description: Datasheet; ComponentLink1URL: http://tunmcdsvn.tun.st.com/Component_Datasheet_Library/Trunk/Resistors/Yageo_Resistor_RC0402-series
R9 R11 R17 R18 = MCD-00333: Resistor, 5K1, 0402, +/-1%, 1/16W; Part_Preference: Recommended; Manufacturer: YAGEO; Manufacturer_Part_Number: RC0402FR-075K1L; Internal_Part_Number: MCD-00333; Status: Released; Part_Type: Resistor; Alternate_Manufacturer: N/A; Alternate_Manufacturer_Part_Number: N/A; Package: 0402; ComponentLink1URL: http://tunmcdsvn.tun.st.com/Component_Documentation_Library/Trunk/Resistor/YAGEO_RC_L_Series; Order_Code_Digikey: 311-5.10KLRCT-ND; Order_Code_Farnell: 1458805; Order_Code_RS: N/A
R10 = MCD-00053: Resistor,10K,0402,1%,1/16W; Manufacturer_Part_Number: RC0402FR-0710KL; Manufacturer: YAGEO; Provided_By: SUBCO; Internal_Part_Number: MCD-00053; Status: Released; ComponentLink1Description: Datasheet; Part_Type: Resistor; ComponentLink1URL: http://tunmcdsvn.tun.st.com/Component_Datasheet_Library/Trunk/Resistors/Yageo_Resistor_RC0402-series; Package: R0402
R12 R16 R19 = MCD-00053: Resistor, 10K, 0402, +/-1%, 1/16W; BMS_Part_Number: 9131590; Part_Preference: Recommended; Manufacturer: YAGEO; Manufacturer_Part_Number: RC0402FR-0710KL; Component_Country_Of_Origin: China; ShowFields: YES; ID: 2539; Internal_Part_Number: MCD-00053; Status: Released; Part_Type: Resistor; Package: 0402; ComponentLink1URL: http://tunmcdsvn.tun.st.com/Component_Documentation_Library/Trunk/Resistor/YAGEO_RC_L_Series; Order_Code_Digikey: 311-10.0KLRCT-ND; Order_Code_Farnell: 9239359; Order_Code_RS: N/A
R13 R14 = MCD-00059: Resistor, 100K, 0402, +/-1%, 1/16W; Part_Preference: Recommended; Manufacturer: YAGEO; Manufacturer_Part_Number: RC0402FR-07100KL; Component_Country_Of_Origin: China; ShowFields: YES; ID: 2533; Internal_Part_Number: MCD-00059; Status: Released; Part_Type: Resistor; Package: 0402; ComponentLink1URL: http://tunmcdsvn.tun.st.com/Component_Documentation_Library/Trunk/Resistor/YAGEO_RC_L_Series; Order_Code_Digikey: 311-100KLRTR-ND; Order_Code_Farnell: 2421891; Order_Code_RS: N/A
R20 = MCD-00409: Resistor, 1K8, 0402, +/-1%, 1/16W; Part_Preference: Recommended; Manufacturer: YAGEO; Manufacturer_Part_Number: RC0402FR-071K8L; Component_Country_Of_Origin: China; Internal_Part_Number: MCD-00409; Status: Released; Part_Type: Resistor; Package: 0402; ComponentLink1URL: http://tunmcdsvn.tun.st.com/Component_Documentation_Library/Trunk/Resistor/YAGEO_RC_L_Series; Order_Code_Digikey: 311-1.80KLRCT-ND; Order_Code_Farnell: 9239260; Order_Code_RS: N/A
R21 = MCD-00381: Resistor, 1K3, 0402, +/-1%, 1/16W; Part_Preference: Recommended; Manufacturer: YAGEO; Manufacturer_Part_Number: RC0402FR-071K3L; Component_Country_Of_Origin: China; ShowFields: YES; ID: 2898; Internal_Part_Number: MCD-00381; Status: Released; Part_Type: Resistor; Package: 0402; ComponentLink1URL: http://tunmcdsvn.tun.st.com/Component_Documentation_Library/Trunk/Resistor/YAGEO_RC_L_Series; Order_Code_Digikey: YAG3036CT-ND; Order_Code_Farnell: 1799176; Order_Code_RS: N/A
R22 = MCD-02455: Resistor, 3K9, 0402, +/-1%, 1/16W, +/-100ppm/°C; Part_Preference: Recommended; Manufacturer: YAGEO; Manufacturer_Part_Number: RC0402FR-073K9L; Order_Code_RS: 198-7783; Component_Country_Of_Origin: China; ShowFields: YES; ID: 4561; Internal_Part_Number: MCD-02455; Status: Released; Part_Type: Resistor; Package: 0402; ComponentLink1URL: http://tunmcdsvn.tun.st.com/Component_Documentation_Library/Trunk/Resistor/YAGEO_RC0402_Series; Order_Code_Digikey: 311-3.90KLRTR-ND; Order_Code_Farnell: 9239308
R44 R45 R47 R49 = MCD-00455: Resistor, 33R, 0402, +/-1%, 1/16W; Part_Preference: Recommended; Manufacturer: YAGEO; Manufacturer_Part_Number: RC0402FR-0733RL; Component_Country_Of_Origin: China; ShowFields: YES; ID: 2821; Internal_Part_Number: MCD-00455; Status: Released; Part_Type: Resistor; Package: 0402; ComponentLink1URL: http://tunmcdsvn.tun.st.com/Component_Documentation_Library/Trunk/Resistor/YAGEO_RC_L_Series; Order_Code_Digikey: 311-33.0LRCT-ND; Order_Code_Farnell: 9239057; Order_Code_RS: N/A
R46 R48 = MCD-00052: Resistor, 0R, 0402, +/-5%, 1/16W; Part_Preference: Recommended; Manufacturer: YAGEO; Manufacturer_Part_Number: RC0402JR-070RL; Order_Code_RS: 618-5804; Component_Country_Of_Origin: China; ShowFields: YES; ID: 2540; Internal_Part_Number: MCD-00052; Status: Released; Part_Type: Resistor; Package: 0402; ComponentLink1URL: http://tunmcdsvn.tun.st.com/Component_Documentation_Library/Trunk/Resistor/YAGEO_RC_L_Series; Order_Code_Digikey: 311-0.0JRCT-ND; Order_Code_Farnell: 9232516RL
R50 = MCD-00052: Resistor, 0R, 0402, +/-5%, 1/16W; Part_Preference: Recommended; Manufacturer: YAGEO; Manufacturer_Part_Number: RC0402JR-070RL; Order_Code_RS: 618-5804; Component_Country_Of_Origin: China; Internal_Part_Number: MCD-00052; Status: Released; Part_Type: Resistor; Package: 0402; ComponentLink1URL: http://tunmcdsvn.tun.st.com/Component_Documentation_Library/Trunk/Resistor/YAGEO_RC_L_Series; Order_Code_Digikey: 311-0.0JRCT-ND; Order_Code_Farnell: 9232516RL
R51 = MCD-00185: Resistor, 3K, 0402, +/-1%, 1/16W; Part_Preference: Recommended; Manufacturer: YAGEO; Manufacturer_Part_Number: RC0402FR-073KL; Component_Country_Of_Origin: China; Internal_Part_Number: MCD-00185; Status: Released; Part_Type: Resistor; Package: 0402; ComponentLink1URL: http://tunmcdsvn.tun.st.com/Component_Documentation_Library/Trunk/Resistor/YAGEO_RC_L_Series; Order_Code_Digikey: 311-3KLRCT-ND; Order_Code_Farnell: 1458777; Order_Code_RS: N/A
TP13 = MCD-00074: Test Point 1mm; Part_Type: Mechanical; Internal_Part_Number: MCD-00074; Status: Released; Provided_By: n/a; Manufacturer_Part_Number: n/a; Manufacturer: n/a; ComponentLink1Description: Datasheet; ComponentLink1URL: http://na
U1 U6 = MCD-00136: Dual Transil array for ESD protection; BMS_Part_Number: 9151112; Part_Type: Diode; Part_Preference: Recommended; Manufacturer: STMICROELECTRONICS; Manufacturer_HQ_COO: EU; Component_Country_Of_Origin: China; Internal_Part_Number: MCD-00136; Value: ESDALC6V1W5; Status: Released; Manufacturer_Part_Number: ESDALC6V1W5; ComponentLink1URL: http://tunmcdsvn.tun.st.com/Component_Datasheet_Library/Trunk/Diodes/STM_ESD_ESDALC6V1W5
U2 = MCD-00649: Common mode filter with ESD protection for USB 2.0 interface; BMS_Part_Number: 9151138; Part_Type: Diode; Part_Preference: Recommended; Manufacturer: STMICROELECTRONICS; Manufacturer_HQ_COO: EU; Component_Country_Of_Origin: China; ShowFields: YES; ID: 3094; Internal_Part_Number: MCD-00649; Value: ECMF02-2AMX6; Status: Released; Manufacturer_Part_Number: ECMF02-2AMX6; ComponentLink1URL: http://tunmcdsvn.tun.st.com/Component_Datasheet_Library/Trunk/Diodes/STM_ESD_ECMF02-2AMX6
U3 = MCD-01207: High power Transient voltage suppressor:25V/35A EOS and ESD transients protection.; Part_Type: Diode; Manufacturer: STMICROELECTRONICS; BMS_Part_Number: 9179045; ECCN_US: EAR99; ECCN_EU: NEC; Provided_By: SUBCO with ST control; Internal_Part_Number: MCD-01207; Status: Checked; Manufacturer_Part_Number: ESDA25P35-1U1M; Package: QFN1610; ComponentLink1Description: Datasheet; ComponentLink1URL: http://tunmcdsvn.tun.st.com/Component_Datasheet_Library/Trunk/Diodes/STM_ESD_ESDA25P35-1U1M
U4 = MCD-00159: 500mA, Enhanced single channel power switches with active high enable pin; Part_Type: IC; Manufacturer: STMICROELECTRONICS; Alternate_Manufacturer_Part_Number: TPS2051C; Alternate_Manufacturer: TEXAS INSTRUMENTS; BMS_Part_Number: 9159009; Provided_By: Subcon; Initial_Board_Reference: MB1264; Internal_Part_Number: MCD-00159; Value: STMPS2151STR; Status: Checked; Manufacturer_Part_Number: STMPS2151STR; ComponentLink1Description: Datasheet; ComponentLink1URL: http://tunmcdsvn.tun.st.com/Component_Datasheet_Library/Trunk/IC/STM_PWR-Switch_STMPS2151STR
U5 = MCD-02706: STM32F723IEK  (STM32F7) BGA176; BMS_Part_Number: 9175300; Part_Type: IC; Part_Preference: Recommended; Manufacturer: STMICROELECTRONICS; Order_Code_RS: 135-8241; ShowFields: YES; ID: 4812; Internal_Part_Number: MCD-02706; Status: New; Manufacturer_Part_Number: STM32F723IEK6; Package: BGA176; ComponentLink1URL: http://tunmcdsvn.tun.st.com/Component_Datasheet_Library/Trunk/IC/BGA176+25L_10x10x0.6_pitch0.65; Order_Code_Digikey: 497-17186-ND; Order_Code_Farnell: 2725149
U7 = MCD-02514: LDO, 3.3V, 300mA, High input voltage: 2.5V to 28V, SOT23-5L; Part_Type: IC; Part_Preference: Recommended; Manufacturer: STMICROELECTRONICS; Internal_Part_Number: MCD-02514; Value: ST730M33R; BMS_Part_Number: N/A; Status: New; Manufacturer_Part_Number: ST730M33R; Alternate_Manufacturer: N/A; Alternate_Manufacturer_Part_Number: N/A; Package: SOT23-5L; ComponentLink1URL: http://tunmcdsvn.tun.st.com/Component_Documentation_Library/Trunk/IC/STMICROELECTRONICS_ST730M33R; Order_Code_Digikey: N/A; Order_Code_Farnell: N/A; Order_Code_RS: N/A
U19 = MCD-02532: eFuse with Fast Overvoltage Protection 2.7V to 18V 4A 34mOhm 8-Pin WSON; Part_Type: IC; Part_Preference: Recommended; Manufacturer: TEXAS INSTRUMENTS; Order_Code_RS: NA; Internal_Part_Number: MCD-02532; Value: TPS259535DSG; Status: New; Manufacturer_Part_Number: TPS259535DSG; Package: WSON8; ComponentLink1URL: http://tunmcdsvn.tun.st.com/Component_Datasheet_Library/Trunk/IC/TI_eFuse_tps2595/TI_eFuse_tps2595.pdf; Order_Code_Digikey: N/A; Order_Code_Farnell: NA
X1 = MCD-01036: Crystal, 24MHz, 6pF, +/-20ppm, 80R, 2x1.6mm; BMS_Part_Number: 9157045; Part_Type: Crystal_Osc; Part_Preference: Recommended; Manufacturer: NDK; Manufacturer_Part_Number: NX2016SA-24MHZ-EXS00A-CS10820; Component_Country_Of_Origin: Unknown; Internal_Part_Number: MCD-01036; Status: Released; Package: 2x1.6mm; ComponentLink1URL: http://tunmcdsvn.tun.st.com/Component_Documentation_Library/Trunk/Crytal_Oscillator/NDK_NX2016SA_Series; Order_Code_Digikey: 644-1365; Order_Code_Farnell: N/A; Order_Code_RS: N/A

## Nets that join several sheets
3V3: Board_Power (JP6.1 SB5.2), User_USB (R38.2), Connectors (CN6.4 CN7.16 R25.1 SB39.1), STLINK_V3EC (CN4.3 R19.2)
5V: Board_Power (10 pins), Connectors (CN6.5 CN7.18), STLINK_V3EC (R11.2)
5V_STLK: Board_Power (JP5.1), STLINK_V3EC (C5.2 C28.2 U4.1 U19.5)
5V_VIN: Board_Power (C38.2 JP5.3 U11.2 U11.4), Connectors (R30.2), STLINK_V3EC (D2.1)
AGND: STM32_microcontroller_power (C43.1 C44.1 SB11.2 U13.12), Connectors (CN10.32)
AVDD: STM32_microcontroller_power (C43.2 C44.2 R33.2 U13.13), Connectors (CN5.8 CN10.7)
E5V: Board_Power (JP5.5), Connectors (CN7.6), STLINK_V3EC (D4.1)
GND: STM32_microcontroller_IOs (14 pins), STM32_microcontroller_power (13 pins), Board_Power (15 pins), User_USB (16 pins), Connectors (11 pins), STLINK_V3EC (108 pins)
VBAT: STM32_microcontroller_power (C53.2 SB38.2 U13.1), Connectors (CN7.33)
VBUS_STLK: Board_Power (JP5.7), Connectors (CN10.8), STLINK_V3EC (14 pins)
VBUSc: Board_Power (JP5.9), User_USB (SB45.2), STLINK_V3EC (D3.1)
VDD: STM32_microcontroller_IOs (B1.1 B1.2), STM32_microcontroller_power (JP2.1), Board_Power (JP6.2), Connectors (CN7.5)
VIN: Board_Power (C41.2 U11.3), Connectors (CN6.8 CN7.24)
ARD_D0_RX: STM32_microcontroller_IOs (SB18.2 SB33.1), Connectors (CN9.1 CN10.37)
ARD_D1_TX: STM32_microcontroller_IOs (SB7.2 SB19.1 SB22.2), Connectors (CN9.2 CN10.35)
BOOT0: STM32_microcontroller_IOs (R31.2 U13.60), Connectors (CN7.7)
MCO: STM32_microcontroller_IOs (SB27.1), STLINK_V3EC (C46.2 R4.2 TP13.1)
PA0: STM32_microcontroller_IOs (SB21.2 U13.14), Connectors (CN7.28 CN8.1)
PA1: STM32_microcontroller_IOs (U13.15), Connectors (CN7.30 CN8.2)
PA5: STM32_microcontroller_IOs (U13.21), Connectors (CN5.6 CN10.11 SB6.1)
PA6: STM32_microcontroller_IOs (U13.22), Connectors (CN5.5 CN10.13)
PA7: STM32_microcontroller_IOs (U13.23), Connectors (CN5.4 CN10.15)
PA8: STM32_microcontroller_IOs (U13.41), Connectors (CN9.8 CN10.23)
PA9: STM32_microcontroller_IOs (U13.42), Connectors (CN10.2)
PA10: STM32_microcontroller_IOs (U13.43), Connectors (CN10.4)
PA11: STM32_microcontroller_IOs (SB13.2 U13.44), Connectors (SB44.2)
PA12: STM32_microcontroller_IOs (SB17.2 U13.45), Connectors (SB12.2)
PA13: STM32_microcontroller_IOs (SB40.2 U13.46), Connectors (CN7.13)
PA14: STM32_microcontroller_IOs (SB41.2 U13.49), Connectors (CN7.15)
PA15: STM32_microcontroller_IOs (R32.2 U13.50), Connectors (CN7.17)
PB0: STM32_microcontroller_IOs (U13.26), Connectors (CN7.34 CN8.4)
PB1: STM32_microcontroller_IOs (U13.27), Connectors (CN7.32 CN8.3)
PB2: STM32_microcontroller_IOs (U13.28), Connectors (CN10.22)
PB3: STM32_microcontroller_IOs (SB15.1 U13.55), Connectors (CN9.4 CN10.31)
PB4: STM32_microcontroller_IOs (U13.56), Connectors (CN9.6 CN10.27)
PB5: STM32_microcontroller_IOs (U13.57), Connectors (CN9.5 CN10.29)
PB6: STM32_microcontroller_IOs (U13.58), Connectors (CN5.10 CN10.3 SB37.2)
PB7: STM32_microcontroller_IOs (U13.59), Connectors (CN5.9 CN10.5 SB34.2)
PB8: STM32_microcontroller_IOs (U13.61), Connectors (CN10.36)
PB10: STM32_microcontroller_IOs (U13.29), Connectors (CN9.7 CN10.25)
PB12: STM32_microcontroller_IOs (U13.33), Connectors (CN10.16)
PB13: STM32_microcontroller_IOs (U13.34), Connectors (CN10.30)
PB14: STM32_microcontroller_IOs (SB19.2 SB20.2 U13.35), Connectors (CN10.28)
PB15: STM32_microcontroller_IOs (SB23.2 SB33.2 U13.36), Connectors (CN10.26)
PC0: STM32_microcontroller_IOs (U13.8), Connectors (SB36.1)
PC1: STM32_microcontroller_IOs (U13.9), Connectors (SB35.1)
PC2: STM32_microcontroller_IOs (U13.10), Connectors (CN7.35)
PC3: STM32_microcontroller_IOs (U13.11), Connectors (CN7.37)
PC4: STM32_microcontroller_IOs (SB42.2 U13.24), Connectors (CN10.34)
PC5: STM32_microcontroller_IOs (U13.25), Connectors (CN10.6)
PC6: STM32_microcontroller_IOs (U13.37), Connectors (CN5.2 CN10.19)
PC7: STM32_microcontroller_IOs (U13.38), Connectors (CN5.1 CN10.21)
PC8: STM32_microcontroller_IOs (U13.39), Connectors (CN9.3 CN10.33)
PC9: STM32_microcontroller_IOs (U13.40), Connectors (CN5.3 CN10.17)
PC10: STM32_microcontroller_IOs (SB43.2 U13.51), Connectors (CN7.1)
PC11: STM32_microcontroller_IOs (U13.52), Connectors (CN7.2)
PC12: STM32_microcontroller_IOs (U13.53), Connectors (CN7.3)
PC13: STM32_microcontroller_IOs (SB16.2 U13.2), Connectors (CN7.23)
PC14: STM32_microcontroller_IOs (SB32.1), Connectors (CN7.25)
PC15: STM32_microcontroller_IOs (SB29.1), Connectors (CN7.27)
PD2: STM32_microcontroller_IOs (U13.54), Connectors (CN7.4)
PF0: STM32_microcontroller_IOs (SB28.1), Connectors (CN7.29)
PF1: STM32_microcontroller_IOs (SB24.1), Connectors (CN7.31)
T_JTDI: STM32_microcontroller_IOs (SB9.1), STLINK_V3EC (CN4.10 R47.2 U6.4)
T_NRST: STM32_microcontroller_IOs (5 pins), Connectors (CN6.3 CN7.14), STLINK_V3EC (CN4.12 R50.2 U1.5)
T_SWCLK: STM32_microcontroller_IOs (SB41.1), STLINK_V3EC (CN4.6 R44.2 U6.1)
T_SWDIO: STM32_microcontroller_IOs (SB40.1), STLINK_V3EC (CN4.4 R45.2 U6.5)
T_SWO: STM32_microcontroller_IOs (SB15.2), STLINK_V3EC (CN4.8 R46.2 U6.3)
T_VCP_RX: STM32_microcontroller_IOs (SB2.2 SB23.1), STLINK_V3EC (CN4.13 R49.2 U1.3)
T_VCP_TX: STM32_microcontroller_IOs (SB1.2 SB3.2 SB20.1), STLINK_V3EC (CN4.14 R48.2 U1.1)
USB_Disconnect: STM32_microcontroller_IOs (SB43.1), User_USB (R34.1)
USB_FS_N: STM32_microcontroller_IOs (SB13.1), User_USB (CN3.A7 CN3.B7 U17.1 U17.6)
USB_FS_P: STM32_microcontroller_IOs (SB17.1), User_USB (5 pins)
VBUS_DET: STM32_microcontroller_IOs (SB42.1), User_USB (R37.1 R40.2)

## Assembly variants
H533RE: not fitted C28 C29 C30 CN2 D2 D3 D4 R18 R20 R21 R22 R34 R51 R54 SB3 SB7 SB12 SB18 SB20 SB21 SB22 SB23 SB24 SB27 SB28 SB29 SB32 SB34 SB37 SB43 SB44 U19
H503RB: not fitted C28 C29 C30 CN2 D2 D3 D4 R18 R20 R21 R22 R34 R51 R54 SB1 SB7 SB12 SB18 SB20 SB21 SB22 SB23 SB24 SB27 SB28 SB29 SB32 SB34 SB37 SB43 SB44 U19